# EAGLE design BattMonTimer (EAGLE 9.6.2)
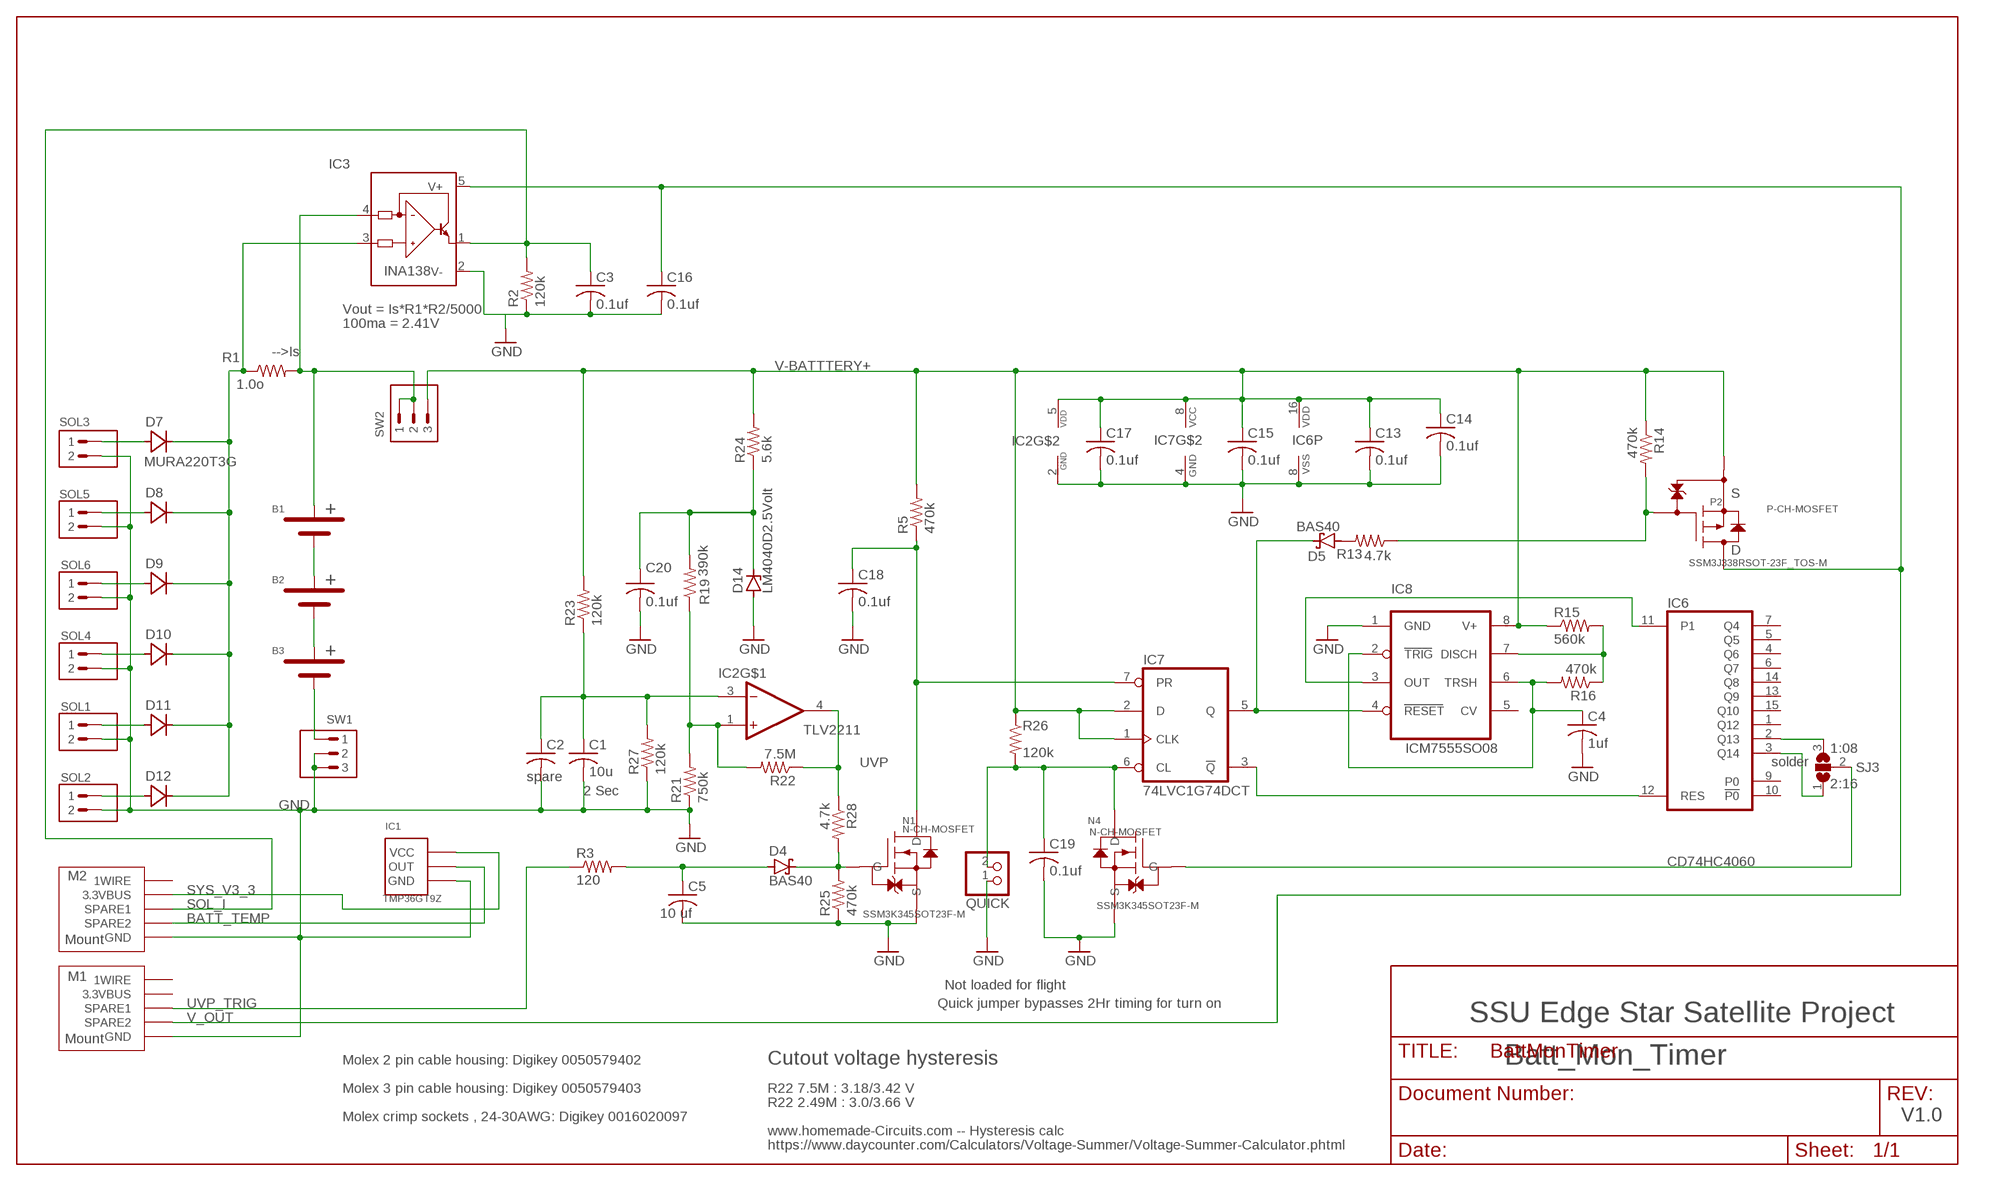
[diagram p0: schematic, sheet 1]

## Parts
B1  AA-BATT  [AA-BATT]
B2  AA-BATT  [AA-BATT]
B3  AA-BATT  [AA-BATT]
C1  10u  C-USC0805  [C0805]
C2  C-USC0805  [C0805]
C3  0.1uf  C-USC0805  [C0805]
C4  1uf  C-USC0805  [C0805]
C5  10 uf  C-USC0805  [C0805]
C13  0.1uf  C-USC0805  [C0805]
C14  0.1uf  C-USC0805  [C0805]
C15  0.1uf  C-USC0805  [C0805]
C16  0.1uf  C-USC0805  [C0805]
C17  0.1uf  C-USC0805  [C0805]
C18  0.1uf  C-USC0805  [C0805]
C19  0.1uf  C-USC0805  [C0805]
C20  0.1uf  C-USC0805  [C0805]
D4  BAS40  [SOT23]
D5  BAS40  [SOT23]
D7  MURA220T3G  [SMA]
D8  MURA220T3G  [SMA]
D9  MURA220T3G  [SMA]
D10  MURA220T3G  [SMA]
D11  MURA220T3G  [SMA]
D12  MURA220T3G  [SMA]
D14  LM4040D2.5Volt  LM4040  [SOT23]
IC1  TMP36GT9Z  [TO92-INLINE]
IC2  TLV2211  TLVB2211  [SOT23-5]
IC3  INA138  [SOT23-5]
IC6  CD74HC4060  4060D  [SO16]
IC7  74LVC1G74DCT  [DCT_R-PDSO-G8]
IC8  ICM7555SO08  [SO08]
M1  Mount  4X8MOUNT  [4X8MOUNT]
M2  Mount  4X8MOUNT  [4X8MOUNT]
N1  SSM3K345SOT23F-M  [SOT-23F_TOS-M]
N4  SSM3K345SOT23F-M  [SOT-23F_TOS-M]
P2  SSM3J338RSOT-23F_TOS-M  [SOT-23F_TOS-M]
QUICK  Quick Start  PINHD-1X2  [1X02]
R1  1.0o  R-US_R1206W  [R1206W]
R2  120k  R-US_R0805  [R0805]
R3  120  R-US_R0805  [R0805]
R5  470k  R-US_R0805  [R0805]
R13  4.7k  R-US_R0805  [R0805]
R14  470k  R-US_R0805  [R0805]
R15  560k  R-US_R0805  [R0805]
R16  470k  R-US_R0805  [R0805]
R19  390k  R-US_R0805  [R0805]
R21  750k  R-US_R0805  [R0805]
R22  7.5M  R-US_R0805  [R0805]
R23  120k  R-US_R0805  [R0805]
R24  5.6k  R-US_R0805  [R0805]
R25  470k  R-US_R0805  [R0805]
R26  120k  R-US_R0805  [R0805]
R27  120k  R-US_R0805  [R0805]
R28  4.7k  R-US_R0805  [R0805]
SJ3  solder  SJ2W  [SJ_2]
SOL1  MOLEX2PINHDR  [MOLEX2PIN]
SOL2  MOLEX2PINHDR  [MOLEX2PIN]
SOL3  MOLEX2PINHDR  [MOLEX2PIN]
SOL4  MOLEX2PINHDR  [MOLEX2PIN]
SOL5  MOLEX2PINHDR  [MOLEX2PIN]
SOL6  MOLEX2PINHDR  [MOLEX2PIN]
SW1  MOLEX3PINHDR  [MOLEX3PIN]
SW2  MOLEX3PINHDR  [MOLEX3PIN]

## Nets
BATT_TEMP: IC1.2(OUT) M2.P$3(SPARE2)
GND: C1.2 C2.2 C3.2 C4.2 C5.2 C13.2 C14.2 C15.2 C16.2 C17.2 C18.2 C19.2 C20.2 D14.2(A) IC1.3(GND) IC2.2(VDD_GND) IC3.2(V-) IC6.8(VSS) IC7.4(GND) IC8.1(GND) M1.P$1(GND) M1.P$8(GND) M2.P$1(GND) M2.P$8(GND) N1.2(S) N4.2(S) QUICK.1 R2.1 R21.1 R25.1 R27.1 SOL1.P$2 SOL2.P$2 SOL3.P$2 SOL4.P$2 SOL5.P$2 SOL6.P$2 SW1.P$2 SW1.P$3
N$1: B1.PLUS(+) IC3.4(IN-) R1.2 SW2.P$1 SW2.P$2
N$4: D7.C D8.C D9.C D10.C D11.C D12.C IC3.3(IN+) R1.1
N$5: C5.1 D4.1(A) R3.2
N$14: D7.A SOL3.P$1
N$15: D8.A SOL5.P$1
N$16: D9.A SOL6.P$1
N$17: D10.A SOL4.P$1
N$18: D11.A SOL1.P$1
N$19: D12.A SOL2.P$1
N$20: B3.MINUS(-) SW1.P$1
N$21: B2.MINUS(-) B3.PLUS(+)
N$22: B1.MINUS(-) B2.PLUS(+)
N$31: D5.3(C) IC7.5(Q) IC8.4(RESET)
N$32: N4.1(G) SJ3.2
N$33: D5.1(A) R13.2
N$34: P2.1 R13.1 R14.2
N$35: IC6.2(Q13) SJ3.3
N$36: IC2.1(+IN) R19.1 R21.2 R22.2
N$37: C1.1 C2.1 IC2.3(-IN) R23.1 R27.2
N$39: C19.1 IC7.6(CL) N4.3(D) QUICK.2 R26.2
N$40: IC6.12(RES) IC7.3(!Q)
N$41: D4.3(C) N1.1(G) R25.2 R28.2
N$42: C20.1 D14.1(C) R19.2 R24.1
N$43: C4.1 IC8.2(TRIG) IC8.6(TRSH) R16.2
N$44: IC8.7(DISCH) R15.2 R16.1
N$45: IC6.11(P1) IC8.3(OUT)
N$48: IC6.3(Q14) SJ3.1
SOL_I: C3.1 IC3.1(OUT) M2.P$6(SPARE1) R2.2
SYS_V3_3: IC1.1(VCC) M2.P$4(3.3VBUS) M2.P$7(3.3VBUS)
UVP: IC2.4(OUT) R22.1 R28.1
UVP_1: C18.1 IC7.7(PR) N1.3(D) R5.1
UVP_TRIG: M1.P$6(SPARE1) R3.1
V-BATTTERY+: C13.1 C14.1 C15.1 C17.1 IC2.5(VDD) IC6.16(VDD) IC7.1(CLK) IC7.2(D) IC7.8(VCC) IC8.8(V+) P2.2 R5.2 R14.1 R15.1 R23.2 R24.2 R26.1 SW2.P$3
V_OUT: C16.1 IC3.5(V+) M1.P$3(SPARE2) P2.3
Unconnected: IC6.1(Q12) IC6.4(Q6) IC6.5(Q5) IC6.6(Q7) IC6.7(Q4) IC6.9(P0) IC6.10(!P0) IC6.13(Q9) IC6.14(Q8) IC6.15(Q10) IC8.5(CV) M1.P$2(1WIRE) M1.P$4(3.3VBUS) M1.P$5(1WIRE) M1.P$7(3.3VBUS) M2.P$2(1WIRE) M2.P$5(1WIRE)

## Notes on the sheet
- Vout = Is*R1*R2/5000
- 100ma = 2.41V
- -->Is
- S
- P-CH-MOSFET
- D
- 1:08
- spare
- 2:16
- 2 Sec
- N-CH-MOSFET
- N-CH-MOSFET
- Quick jumper bypasses 2Hr timing for turn on
- SSU Edge Star Satellite Project
- Molex 2 pin cable housing: Digikey 0050579402 | Cutout voltage hysteresis | Batt_Mon_Timer
- Molex 3 pin cable housing: Digikey 0050579403 | R22 7.5M : 3.18/3.42 V
- R22 2.49M : 3.0/3.66 V
- Molex crimp sockets , 24-30AWG: Digikey 0016020097 | V1.0
- www.homemade-Circuits.com -- Hysteresis calc
- https://www.daycounter.com/Calculators/Voltage-Summer/Voltage-Summer-Calculator.phtml

## Library data of the parts
B1-B3 = BattMonTimer:AA-BATT: NiCD or NIMH battery AA formfactor with ziptie strapping option; DIGIKEY: SY115T-ND
C1 C2 C5 = rcl:C-US: CAPACITOR, American symbol; DIGIKEY: 490-14381-1-ND; SPICEPREFIX: C
C3 C13-C20 = rcl:C-US: CAPACITOR, American symbol; DIGIKEY: 1276-1099-1-ND; SPICEPREFIX: C
C4 = rcl:C-US: CAPACITOR, American symbol; DIGIKEY: 311-3497-1-ND; SPICEPREFIX: C; TYPE: X7R
D4 D5 = diode:BAS40: Silicon Schottky Diodes General-purpose diode for high-speed switching; DIGIKEY: BAS40-04FDICT-ND
D7-D12 = BattMonTimer:MURA220T3G: Surface Mount Schottky Power Rectifier Source: http://www.onsemi.com/pub_link/Collateral/MBRA340T3-D.PDF; DIGIKEY: MURA220T3GOSCT-ND
D14 = BattMonTimer:LM4040; DIGIKEY: LM4040D25FCT-ND
IC1 = BattMonTimer:TMP36GT9Z; DIGIKEY: TMP36GT9Z-ND
IC2 = BattMonTimer:TLVB2211: TI Rail to Rail LINCMOS op-amp; DIGIKEY: 296-10500-1-ND
IC3 = burr-brown:INA138: High-Side Measurement Current Shunt Monitor; DIGIKEY: 296-17936-2-ND; MF: TEXAS INSTRUMENTS; MPN: INA138NA/250; OC_FARNELL: 1564888; OC_NEWARK: 80K5906
IC6 = BattMonTimer:4060: 14-stage binary/ripple COUNTER; DIGIKEY: 296-25999-1-ND
IC7 = BattMonTimer:74*1G74: D type flipflo with async Set and Clear; DIGIKEY: SN74LVC1G74DCTR
IC8 = BattMonTimer:ICM7555: TIMER; DIGIKEY: ICM7555CBAZ-TCT-ND
M1 M2 = BattMonTimer:4X8MOUNT: 4x8 MOUNT for EDGEQUBE; NO_PN: Hole pattern template
N1 N4 = BattMonTimer:SSM3K345; DIGIKEY: SSM3K345RLFCT-ND
P2 = BattMonTimer:SSM3J338R; DIGIKEY: SSM3J338RLFECT-ND; MANUFACTURER_PART_NUMBER: SSM3J338R; SOURCELIBRARY: Toshiba_2018-12-14; VENDOR: Toshiba
QUICK = BattMonTimer:PINHD-1X2: PIN HEADER; NOTPOPULATED: Not loaded for flight
R1 = rcl:R-US_: RESISTOR, American symbol; DIGIKEY: RNCP1204FTD1R00CT-ND; SPICEPREFIX: R
R2 R23 R26 R27 = rcl:R-US_: RESISTOR, American symbol; DIGIKEY: 2019-RK73H2ATTD1203FCT-ND; SPICEPREFIX: R
R3 R13 R28 = rcl:R-US_: RESISTOR, American symbol; DIGIKEY: 311-4.7KARCT-ND; SPICEPREFIX: R
R5 R14 R16 R25 = rcl:R-US_: RESISTOR, American symbol; DIGIKEY: 2019-RK73H2ATTD4703FCT-ND; SPICEPREFIX: R
R15 = rcl:R-US_: RESISTOR, American symbol; DIGIKEY: 2019-RK73H2ATTD5603FCT-ND; SPICEPREFIX: R
R19 = rcl:R-US_: RESISTOR, American symbol; DIGIKEY: RK73H2ATTD3903FCT-ND; SPICEPREFIX: R
R21 = rcl:R-US_: RESISTOR, American symbol; DIGIKEY: 2019-RK73H2ATTD7503FCT-ND; SPICEPREFIX: R
R22 = rcl:R-US_: RESISTOR, American symbol; DIGIKEY: 541-7.50MCCT-ND; SPICEPREFIX: R
R24 = rcl:R-US_: RESISTOR, American symbol; DIGIKEY: 2019-RK73H2ATTD5601FCT-ND; SPICEPREFIX: R
SJ3 = jumper:SJ2W: SMD solder JUMPER
SOL1-SOL6 = BattMonTimer:MOLEX2PINHDR: molex 2 pin header with schroud and lock , pn 070543001; DIGIKEY: 0705430001
SW1 SW2 = BattMonTimer:MOLEX3PINHDR: Molex 3 pin header with shroud and lock PN:0705430002; DIGIKEY: 0705430002

## Board
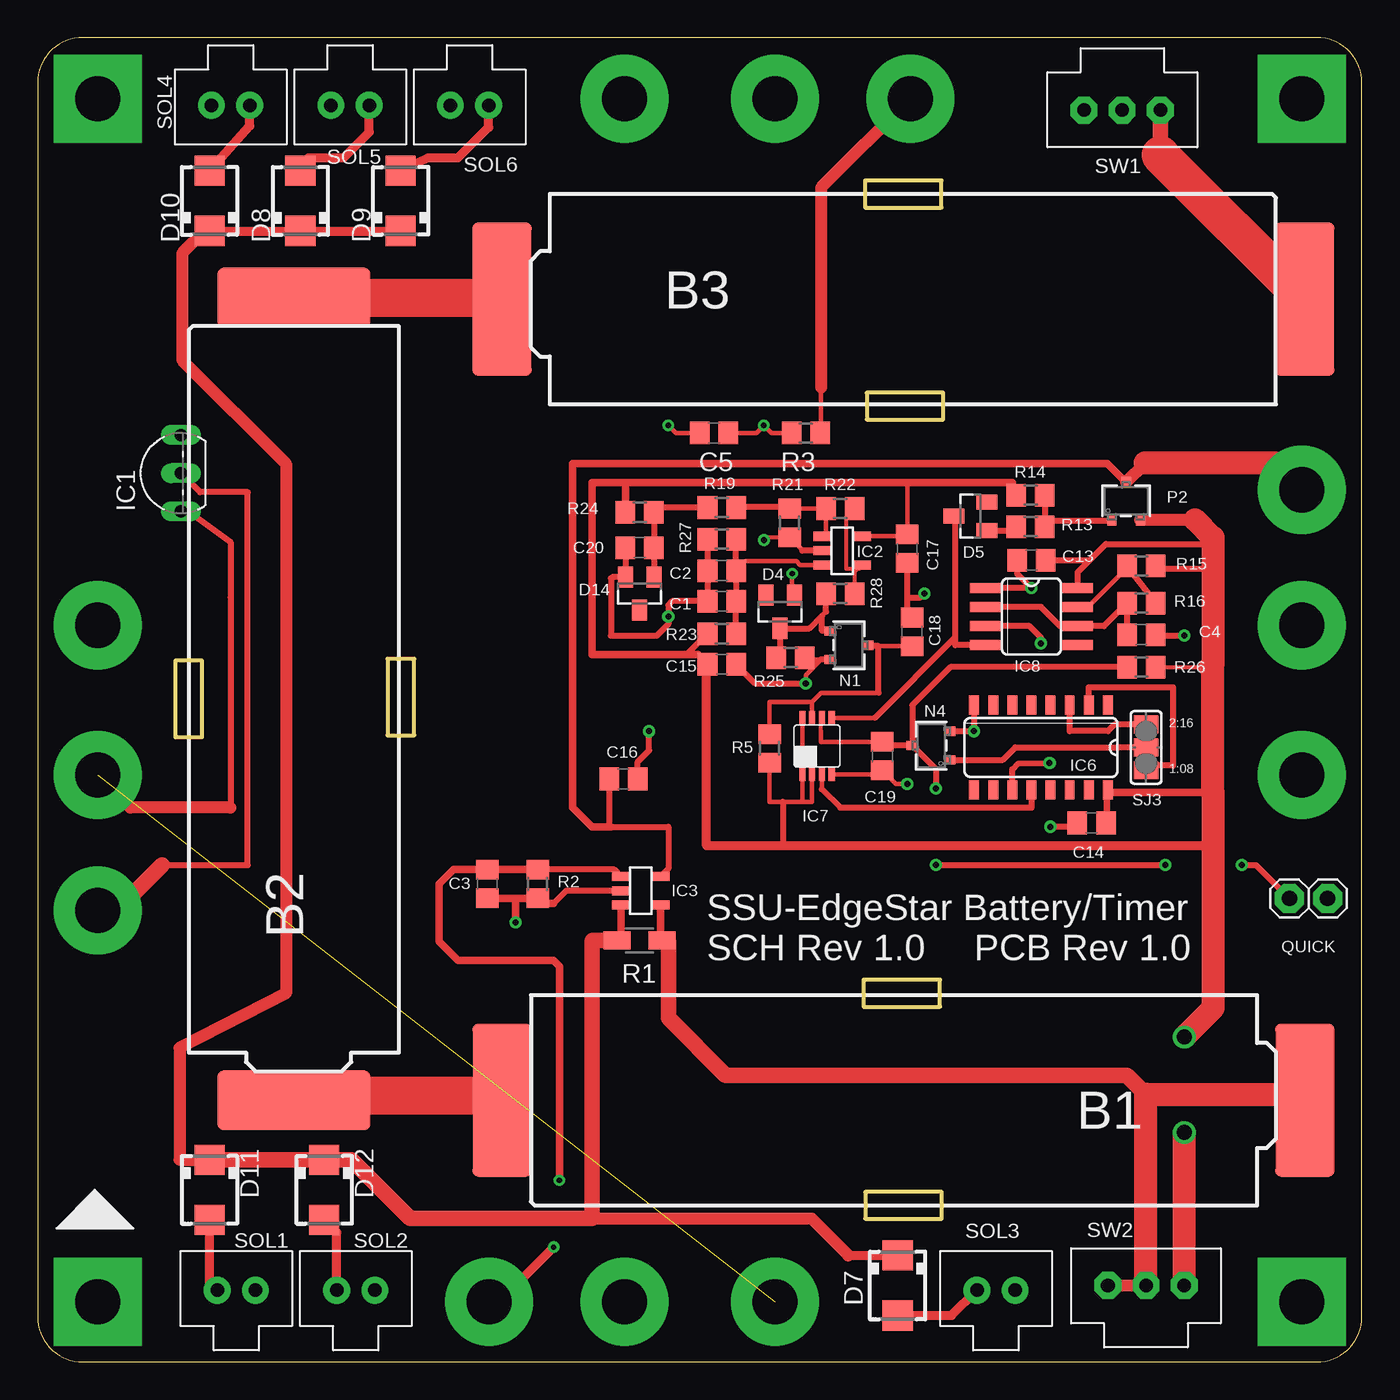
[diagram p1: board, top side]
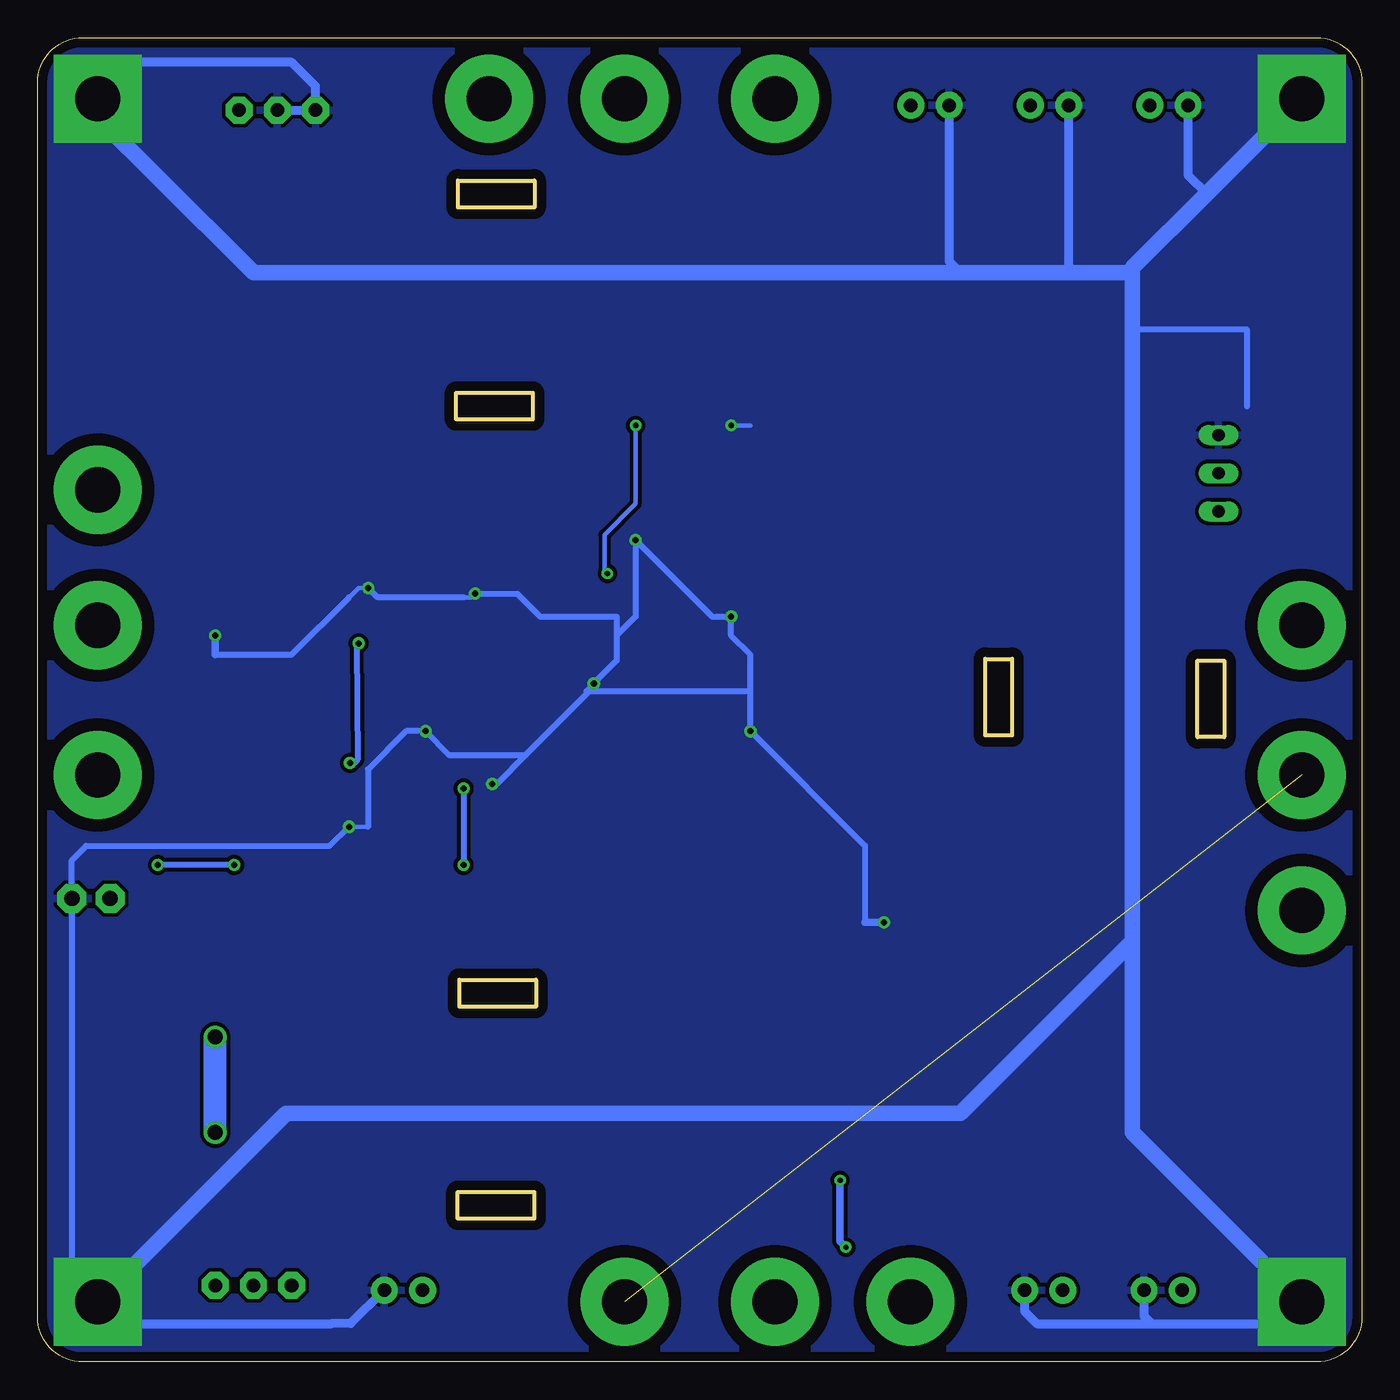
[diagram p2: board, bottom side, seen from below]

Size 88 x 88 mm. Coordinates in mm from the lower left corner, seen from the top.
Outline: 0,85 0,3 arc90 3,0 85,0 arc90 88,3 88,85 arc90 85,88 3,88 arc90 0,85
Copper layers (1*16): Top 0.035mm / dielectric 1.5mm / Bottom 0.035mm
Design rules "default *": minimum track width 6mil, minimum drill 0.35mm, track to track 10mil, track to pad 10mil, pad to pad 9mil, via to via 12mil, smd to smd 6mil, copper to edge 25mil, drill to drill 6mil, minimum pad ring 10mil, minimum via ring 8mil, stop-mask expansion 4mil, vias tented up to drill 0mil, thermal gap 10mil

### Footprints (pad centres in the part's own frame; a part is rotated, then mirrored left to right if it is on the bottom)
AA-BATT = smd 3.937 x 10.16: MINUS 26.67,0; PLUS -26.67,0
C0805 = smd 1.3 x 1.5: 1 -0.95,0; 2 0.95,0
SOT23 = smd 1 x 1.4: 1 -0.95,-1.1; 2 0.95,-1.1; 3 0,1.1
SMA = smd 2 x 2: A 2,0; C -2,0
TO92-INLINE = drill 0.813 long: 1 -2.54,0; 2 0,0; 3 2.54,0
SOT23-5 = smd 0.6 x 1.2: 1 -0.95,-1.306; 2 0,-1.306; 3 0.95,-1.306; 4 0.95,1.306; 5 -0.95,1.306
SO16 = smd 0.66 x 1.27: 1 -4.445,-2.819; 2 -3.175,-2.819; 3 -1.905,-2.819; 4 -0.635,-2.819; 5 0.635,-2.819; 6 1.905,-2.819; 7 3.175,-2.819; 8 4.445,-2.819; 9 4.445,2.819; 10 3.175,2.819; 11 1.905,2.819; 12 0.635,2.819; 13 -0.635,2.819; 14 -1.905,2.819; 15 -3.175,2.819; 16 -4.445,2.819
DCT_R-PDSO-G8 = smd 0.4 x 0.914: 1 -0.975,-1.875; 2 -0.325,-1.875; 3 0.325,-1.875; 4 0.975,-1.875; 5 0.975,1.875; 6 0.325,1.875; 7 -0.325,1.875; 8 -0.975,1.875
SO08 = smd 0.66 x 2.032: 1 -1.905,-3.073; 2 -0.635,-3.073; 3 0.635,-3.073; 4 1.905,-3.073; 5 1.905,3.073; 6 0.635,3.073; 7 -0.635,3.073; 8 -1.905,3.073
4X8MOUNT = drill 3 pad 5.85 square: P$1 84,4; P$8 4,4 | drill 3 pad 5.85: P$2 83.998,39; P$3 4,30; P$4 49,4; P$5 39,4; P$6 30,4; P$7 4,39
SOT-23F_TOS-M = smd 0.61 x 0.762: 1 -0.95,-1.245; 2 0.95,-1.245; 3 0,1.245
1X02 = drill 1.016 pad 1.93 octagon: 1 -1.27,0; 2 1.27,0
R1206W = smd 1.8 x 1.2: 1 -1.499,0; 2 1.499,0
R0805 = smd 1.3 x 1.5: 1 -0.95,0; 2 0.95,0
SJ_2 = smd 1.168 x 1.6: 1 -1.524,0; 2 0,0; 3 1.524,0
MOLEX2PIN = drill 0.9 pad 1.778: P$1 1.397,1.27; P$2 -1.143,1.27
MOLEX3PIN = drill 0.9 pad 1.778 octagon: P$1 2.54,1.27; P$2 0,1.27; P$3 -2.54,1.27

### Placement (x,y rotation side)
B1  57.55,17.38 180 top
B2  17.03,44.05 90 top
B3  57.52,70.62 0 top
C1  45.47,50.55 180 top
C2  45.47,52.58 180 top
C3  29.88,31.76 270 top
C4  73.34,48.32 0 top
C5  44.95,61.73 180 top
C13  66.04,53.28 180 top
C14  70.04,35.81 180 top
C15  45.47,46.35 0 top
C16  38.93,38.73 0 top
C17  57.78,54.04 270 top
C18  58.1,48.51 90 top
C19  56.13,40.26 270 top
C20  40.01,54.1 180 top
D4  49.34,49.85 180 top
D5  61.98,56.2 90 top
D7  57.15,5.08 270 top
D8  17.46,77.15 90 top
D9  24.13,77.16 90 top
D10  11.43,77.15 90 top
D11  11.43,11.43 270 top
D12  19.05,11.43 270 top
D14  40.01,51.05 180 top
IC1  9.53,59.05 90 top
IC2  53.47,53.91 270 top
IC3  40.08,31.31 270 top
IC6  66.67,40.83 180 top
IC7  51.79,40.92 0 top
IC8  66.04,49.53 270 top
M1  88,87.95 180 top
M2  0,0 0 top
N1  53.91,47.62 270 top
N4  59.37,40.96 90 top
P2  72.33,57.21 0 top
QUICK  84.45,30.8 180 top
R1  40,28 0 top
R2  33.23,31.76 90 top
R3  51.05,61.73 180 top
R5  48.64,40.77 270 top
R13  65.98,55.5 180 top
R14  65.98,57.59 0 top
R15  73.34,52.9 180 top
R16  73.34,50.42 180 top
R19  45.47,56.77 180 top
R21  49.97,55.75 90 top
R22  53.34,56.71 180 top
R23  45.47,48.39 180 top
R24  40.01,56.45 180 top
R25  50.04,46.8 180 top
R26  73.34,46.16 180 top
R27  45.47,54.67 0 top
R28  53.34,51.05 180 top
SJ3  73.66,40.83 270 top
SOL1  13.34,6.03 180 top
SOL2  21.27,6.03 180 top
SOL3  63.82,6.03 180 top
SOL4  12.7,82.23 0 top
SOL5  20.64,82.23 0 top
SOL6  28.58,82.23 0 top
SW1  72.07,81.92 0 top
SW2  73.66,6.35 180 top

### Tracks (layer width: path | path; a pad name or v marks a point on that pad's centre or on a via)
BATT_TEMP
  Top 0.406: 8.29,33.02 13.97,33.02 13.97,57.78 10.79,57.78 IC1.2
  Top 1.016: M2.P$3 5.27,30 8.29,33.02
GND  (via drill 0.35, 0.4)
  Top 0.254: C4.2 74.36,48.26 | v48.26,54.61 48.45,54.8 R21.1
  Top 0.305: R21.1 50.8,53.98 50.8,53.91 | R25.1 50.99,46.67 52.07,46.67 51.04,45.65 v51.04,45.09 | v57.78,38.41 57.03,38.41 C19.2 55.87,39.05 IC7.4 | C18.2 57.78,49.78 | 58.67,50.8 v58.93,51.05 | C14.2 68.84,35.56 | C5.2 42.41,61.73 v41.91,62.23
  Top 0.406: IC2.2 50.8,53.91 | 74.36,48.26 v76.2,48.26 | IC8.1 v66.04,51.44 65.09,52.38 C13.2 | IC6.8 v62.23,41.91 N4.2 | R27.1 C2.2 C1.2 42.16,50.55 41.91,50.29 v41.91,49.53 41.91,49.02 41.15,48.26 38.1,48.26 38.1,52.07 38.18,52.15 D14.2 C20.2 | N1.2 52.07,46.67 | 57.78,49.78 57.78,50.8 | 57.78,50.8 C17.2 | 57.78,50.8 58.67,50.8 | 68.84,35.56 v67.31,35.56 | C15.2 47.69,45.09 v51.04,45.09 | IC3.2 35.12,31.31 34.29,30.48 | C16.2 39.88,39.88 40.64,40.64 v40.64,41.91
  Top 0.508: 34.29,30.48 33.56,30.48 R2.1 31.75,30.81 | 31.75,30.81 C3.2 | 31.75,30.81 v31.75,29.21
  Bottom 0.254: 7.61,63.49 7.62,63.5
  Bottom 0.305: v66.04,51.44 66.67,51.44 67.31,50.8 | v58.93,51.05 59.18,50.8 59.69,50.8 | 51.31,44.58 50.8,44.58 | v51.04,45.09 51.55,44.58 | 66.04,35.56 v67.31,35.56 | v41.91,62.23 40.64,62.23
  Bottom 0.406: 7.62,63.5 7.62,68.58 15.24,68.58 | 40.64,44.45 v40.64,41.91 33.02,34.29 33.02,29.21 | 40.64,44.45 40.64,46.99 41.91,48.26 v41.91,49.53 43.18,49.53 v48.26,54.61 48.26,49.53 49.53,48.26 | 51.55,44.58 50.8,44.58 40.77,44.58 40.64,44.45 | v57.78,38.41 57.47,38.41 55.56,40.32 | 55.56,40.32 51.31,44.58 | 66.04,35.56 66.04,39.37 63.5,41.91 v62.23,41.91 60.64,40.32 55.56,40.32 | 76.2,46.99 71.12,46.99 67.31,50.8 | 59.69,50.8 65.41,50.8 v66.04,51.44 | v58.93,51.05 56.13,51.05 54.61,49.53 49.53,49.53 49.53,48.26 | v67.31,35.56 68.58,34.29 84.77,34.29 85.72,33.34 QUICK.1 85.72,5.72 M2.P$1 | 49.53,48.26 49.53,46.6 v51.04,45.09
  Bottom 0.508: v76.2,48.26 76.2,46.99 | 33.02,29.21 v31.75,29.21
  Bottom 0.61: SOL4.P$2 11.56,78.87 10.32,77.63 | SOL5.P$2 19.49,72.83 19.05,72.39 | SOL6.P$2 27.43,73.15 26.67,72.39 | M1.P$8 81.59,86.36 71.12,86.36 69.53,84.77 SW1.P$3 SW1.P$2 | SOL1.P$2 14.48,3.05 13.97,2.54 | 13.97,2.54 6.35,2.54 | SOL2.P$2 22.42,3.37 21.59,2.54 13.97,2.54 | SOL3.P$2 67.19,2.56 67.18,2.56 68.45,2.54 82.54,2.54
  Bottom 0.813: M2.P$8 5.46,2.54 6.35,2.54 | M2.P$1 82.54,2.54
  Bottom 1.016: M1.P$8 83.87,82.55 80.01,78.74 73.66,72.39 26.67,72.39 19.05,72.39 15.24,72.39 | M1.P$1 10.32,77.63 15.24,72.71 15.24,72.39 | 15.24,27.94 15.24,68.58 15.24,72.39 | 15.24,27.94 26.67,16.51 71.49,16.51 M2.P$1 | 15.24,27.94 15.24,15.24 M2.P$8
  pour Bottom: 3,87.63 84.63,87.63 arc-90 87.63,84.63 87.63,3 arc-90 84.63,0 3,0 arc-90 0,3 0,84.63 arc-90
N$1
  Top 0.508: IC3.4 41.39,28.44 R1.2
  Top 0.813: SW2.P$1 SW2.P$2 | 83.82,17.78 B1.PLUS | 41.91,27.94 41.85,28
  Top 1.016: 73.66,17.78 72.39,19.05 45.72,19.05 41.91,22.86 41.91,27.94 | 41.85,28 R1.2
  Top 1.524: SW2.P$2 73.66,17.78 83.82,17.78
N$4
  Top 0.305: D10.C 11.11,75.15
  Top 0.508: 18.32,13.43 19.05,12.7 D12.C | D9.C | IC3.3 38.77,28.28 R1.1
  Top 0.61: D10.C D8.C D9.C | 53.88,7.08 D7.C
  Top 0.813: D11.C 9.43,13.43 9.43,20.86 16.51,24.5 16.51,59.69 9.62,66.58 9.62,73.66 11.11,75.15 | 36.83,9.53 51.44,9.53 53.88,7.08 | 36.83,27.94 36.89,28
  Top 1.016: D11.C 18.32,13.43 | D12.C 20.86,13.43 24.77,9.53 36.83,9.53 36.83,27.94 | 36.89,28 R1.1
N$5  (via drill 0.35)
  Top 0.305: R3.2 48.76,61.73 v48.26,62.23 47.76,61.73 C5.1 | v50.14,52.39 50.14,51.1 D4.1
  Bottom 0.305: v48.26,62.23 48.26,57.02 50.34,54.95 50.34,52.59 v50.14,52.39
N$14
  Top 0.61: D7.A 60.74,3.08 SOL3.P$1
N$15
  Top 0.508: D8.A 18,80.01
  Top 0.61: 18,80.01 20.32,80.01 22.03,81.72 SOL5.P$1
N$16
  Top 0.61: D9.A 25.93,80.01 27.94,80.01 29.97,82.04 SOL6.P$1
N$17
  Top 0.61: D10.A 14.1,82.14 SOL4.P$1
N$18
  Top 0.61: SOL1.P$1 11.43,5.27 D11.A
N$19
  Top 0.61: SOL2.P$1 19.88,8.6 D12.A
N$20
  Top 1.016: 74.61,80.2 SW1.P$1
  Top 2.54: B3.MINUS 74.61,80.2
N$21
  Top 1.016: 29.61,70.72 30.28,70.05 B3.PLUS
  Top 2.54: B2.MINUS 29.61,70.72
N$22
  Top 0.813: 30.56,17.7 B1.MINUS
  Top 1.016: B2.PLUS 17.34,17.7
  Top 2.54: 17.34,17.7 30.56,17.7
N$31
  Top 0.305: 60.96,55.88 60.88,55.96 D5.3 | IC7.5 55.63,42.8
  Top 0.406: IC8.4 60.96,47.62 60.96,48.13 | 55.63,42.8 60.96,48.13 | 60.96,55.88 60.96,48.13
N$32
  Top 0.406: N4.1 64.14,40.01 64.96,40.83 71.88,40.83 72.14,40.83 SJ3.2
N$33
  Top 0.305: R13.2 64.85,55.24
  Top 0.406: D5.1 64.85,55.24
N$34
  Top 0.305: 66.93,55.88 R13.1
  Top 0.406: R14.2 66.93,55.88 71.29,55.88 P2.1
N$35
  Top 0.305: 73.98,39.62 SJ3.3
  Top 0.406: IC6.2 69.85,44.83 75.44,44.83 75.44,39.62 73.98,39.62
N$36
  Top 0.305: 50.1,56.83 R21.2 R22.2 52.39,55.09 IC2.1 | R19.1 46.48,56.83
  Top 0.406: 46.48,56.83 50.1,56.83
N$37
  Top 0.305: IC2.3 50.67,52.96 50.42,53.21 47.05,53.21 C2.1
  Top 0.406: R23.1 C1.1 C2.1 R27.2
N$39  (via drill 0.4)
  Top 0.254: 52.07,41.91 52.07,42.75 IC7.6
  Top 0.305: 56.13,40.96 C19.1 52.07,41.21 52.07,41.91
  Top 0.406: N4.3 56.13,40.96 | N4.3 58.13,43.65 60.64,46.16 R26.2 | N4.3 59.69,39.4 v59.69,38.1 | v80.01,33.02 80.96,33.02 QUICK.2 | v59.69,33.02 v74.93,33.02
  Bottom 0.406: v59.69,38.1 v59.69,33.02 | v74.93,33.02 v80.01,33.02
N$40
  Top 0.305: IC7.3 52.12,38.05
  Top 0.406: IC6.12 66.04,36.83 53.34,36.83 52.12,38.05
N$41
  Top 0.305: 49.34,47.05 R25.2 | 52.14,49.6 52.39,49.85
  Top 0.406: 49.34,47.05 D4.3 51.29,48.75 52.14,49.6 52.14,48.58 N1.1 | 52.39,49.85 R28.2
N$42
  Top 0.305: 41.27,56.77 R24.1
  Top 0.406: R19.2 41.27,56.77 | R24.1 C20.1 D14.1
N$43
  Top 0.406: IC8.2 66.67,50.16 67.94,48.9 IC8.6 70.87,48.9 R16.2 C4.1
N$44
  Top 0.305: IC8.7 69.79,50.16 72.39,52.77 R15.2
  Top 0.406: R15.2 R16.1
N$45  (via drill 0.4)
  Top 0.406: IC6.11 64.77,39.37 65.15,39.75 v67.25,39.8 | IC8.3 65.91,48.9 66.67,48.13 v66.67,47.75
  Bottom 0.305: 66.8,47.62 v66.67,47.75
  Bottom 0.406: 66.8,47.62 66.75,40 66.95,39.8 v67.25,39.8
N$48
  Top 0.406: SJ3.1 71.56,42.35 71.12,41.91 68.58,41.91 IC6.3
SOL_I  (via drill 0.35)
  Top 0.406: IC3.1 38.32,32.71 R2.2
  Top 0.508: R2.2 C3.1 27.63,32.71 26.67,31.75 26.67,27.94 27.94,26.67 34.29,26.67 34.67,26.29 v34.67,12.06
  Top 0.61: v34.29,7.62 30.67,4 M2.P$6
  Bottom 0.508: v34.67,12.06 34.67,8 v34.29,7.62
SYS_V3_3  (1 unrouted)
  Top 0.406: IC1.1 10.27,56.34 12.82,54.49 12.82,50.8 12.82,36.83
  Top 0.813: 12.82,36.83 6.17,36.83 M2.P$7
UVP
  Top 0.254: R22.1 53.72,56.14 53.72,52.71 54.61,52.71 54.86,52.96 IC2.4 54.29,52.48 R28.1
UVP_1
  Top 0.305: R5.1 48.64,43.85 51.47,43.85 | C18.1 55.88,47.56 | 51.47,43.85 52.07,44.45 55.88,44.45 | IC7.7 51.47,43.85
  Top 0.406: 55.88,44.45 55.88,47.56 55.22,47.56 N1.3
UVP_TRIG
  Top 0.305: 52.07,64.77 52.07,61.8 R3.1
  Top 0.813: M1.P$6 52.07,78.02 52.07,64.77
V-BATTTERY+  (via drill 1)
  Top 0.254: R26.1 77.92,46.16
  Top 0.305: R15.1 74.48,52.7 | 50.82,37.21 IC7.1 IC7.8 | 50.82,37.21 49.53,37.21 48.64,37.21 R5.2 | IC7.2 51.47,37.21 50.82,37.21 | R14.1 64.77,58.1 64.77,58.42 | 71.28,37.85 70.99,37.55 C14.1 71.12,35.94 IC6.16 | IC2.5 57.66,54.86 C17.1 57.78,58.42 | C15.1 43.88,46.99
  Top 0.406: 78.11,54.36 70.99,54.36 69.91,53.28 | IC8.8 69.11,52.48 69.91,53.28 | 74.48,52.7 78.11,52.7 | R23.2 43.12,46.99 | C13.1 69.91,53.28 | 49.53,37.21 49.53,34.29
  Top 0.508: R24.2 39.05,58.42 | 64.77,58.42 57.78,58.42 39.05,58.42 | 78.11,53.34 78.11,54.36 | 71.28,37.85 78.11,37.85 | 39.05,58.42 36.83,58.42 36.83,46.99 43.12,46.99 43.88,46.99
  Top 0.61: 78.11,34.29 49.53,34.29 44.45,34.29 44.45,46.35 C15.1
  Top 0.813: P2.2 76.92,55.97
  Top 1.016: v76.2,15.24
  Top 1.524: SW2.P$3 v76.2,15.24 | v76.2,21.59 78.11,23.5 78.11,34.29 78.11,37.85 78.11,46.35 | 78.11,46.35 78.11,52.7 78.11,53.34 78.11,54.78 76.92,55.97 | 78.11,46.35 77.92,46.16
  Bottom 1.524: v76.2,15.24 v76.2,21.59
V_OUT
  Top 0.406: IC3.5 41.91,32.78 41.91,35.56 38.1,35.56 37.98,35.68 C16.1
  Top 0.508: P2.3 71.09,59.69 35.56,59.69 35.56,36.83 36.83,35.56 38.1,35.56
  Top 0.813: P2.3 73.6,59.73
  Top 1.524: 73.6,59.73 82.22,59.73 M1.P$3

### Text on the board
tPlace: 2:16 | 1:08 | SSU-EdgeStar Battery/Timer | SCH Rev 1.0 | PCB Rev 1.0